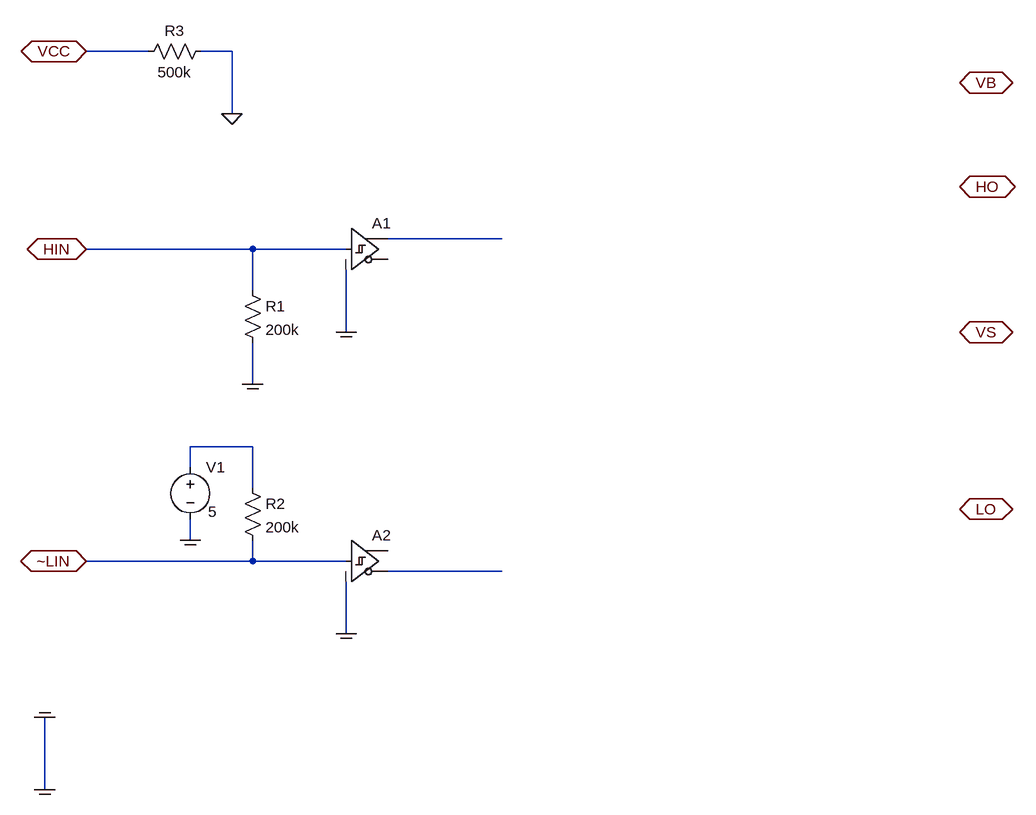
[diagram p0: schematic IR2183_Behavioral.asc]
IR2183_Behavioral.asc, the LTspice schematic file:
Version 4.1
SHEET 1 1296 1396
WIRE -1104 -320 -1200 -320
WIRE -976 -320 -1024 -320
WIRE -976 -224 -976 -320
WIRE -560 -32 -736 -32
WIRE -944 -16 -1200 -16
WIRE -800 -16 -944 -16
WIRE -944 48 -944 -16
WIRE -800 112 -800 16
WIRE -944 192 -944 128
WIRE -944 288 -1040 288
WIRE -1040 320 -1040 288
WIRE -944 352 -944 288
WIRE -1040 432 -1040 400
WIRE -944 464 -944 432
WIRE -944 464 -1200 464
WIRE -800 464 -944 464
WIRE -560 480 -736 480
WIRE -800 576 -800 496
WIRE -1264 816 -1264 704
FLAG -1200 -16 HIN
IOPIN -1200 -16 BiDir
FLAG -1200 464 ~LIN
IOPIN -1200 464 BiDir
FLAG -1264 704 COM
IOPIN -1264 704 BiDir
FLAG -1200 -320 VCC
IOPIN -1200 -320 BiDir
FLAG 144 -112 HO
IOPIN 144 -112 BiDir
FLAG 144 112 VS
IOPIN 144 112 BiDir
FLAG 144 384 LO
IOPIN 144 384 BiDir
FLAG 144 -272 VB
IOPIN 144 -272 BiDir
FLAG -1264 816 COM
FLAG -800 576 COM
FLAG -800 112 COM
FLAG -944 192 COM
FLAG -1040 432 COM
FLAG -976 -224 0
SYMBOL Digital\\schmitt -800 -80 R0
SYMATTR InstName A1
SYMBOL Digital\\schmitt -800 400 R0
SYMATTR InstName A2
SYMBOL res -960 32 R0
SYMATTR InstName R1
SYMATTR Value 200k
SYMBOL res -960 336 R0
SYMATTR InstName R2
SYMATTR Value 200k
SYMBOL voltage -1040 304 R0
WINDOW 3 27 84 Left 2
WINDOW 123 0 0 Left 0
WINDOW 39 0 0 Left 0
SYMATTR InstName V1
SYMATTR Value 5
SYMBOL res -1008 -336 R90
WINDOW 0 0 56 VBottom 2
WINDOW 3 32 56 VTop 2
SYMATTR InstName R3
SYMATTR Value 500k

The netlist it stands for:
* IR2183_Behavioral.asc
A1 HIN COM COM COM COM COM N001 COM SCHMITT
A2 ~LIN COM COM COM COM N003 COM COM SCHMITT
R1 HIN COM 200k
R2 N002 ~LIN 200k
V1 N002 COM 5
R3 0 VCC 500k
.backanno
.end